# Altium project HDsEMG V1.0.PrjPcb
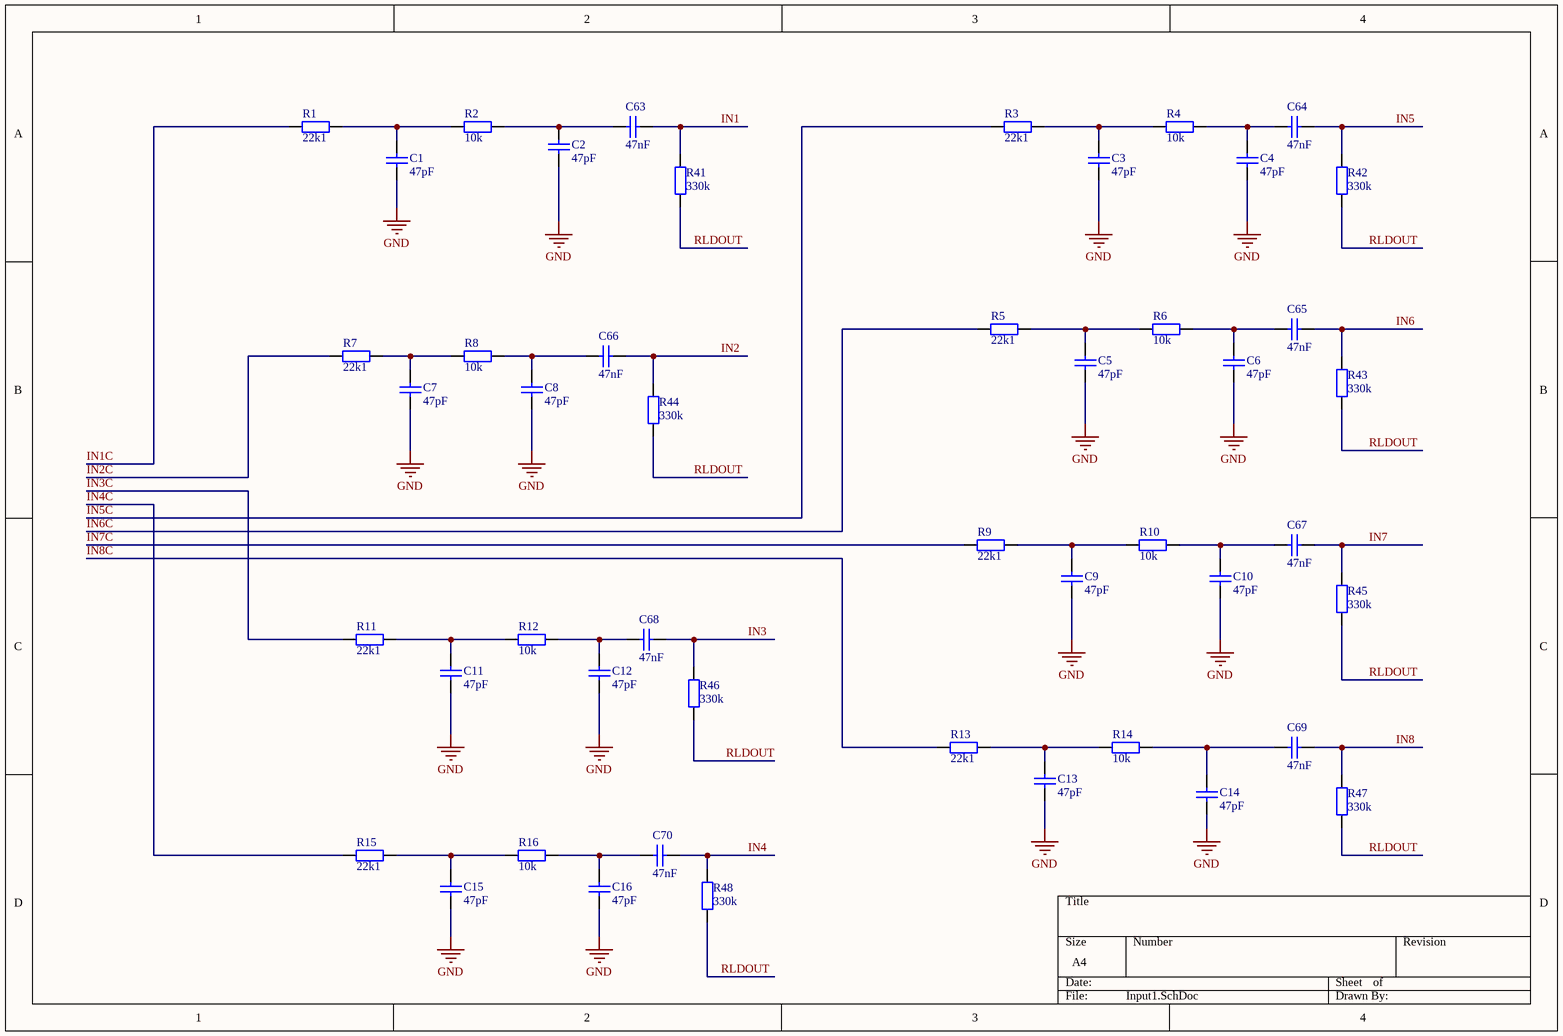
[diagram p0: Input1.SchDoc]
5 sheets, 160 parts. Net scope: global (net labels, ports and power ports of the same name join across sheets).
Board file: HDsEMG.PcbDoc
Sheets:
  Input1.SchDoc
  Input2.SchDoc
  ADS1298.SchDoc
  Power supply.SchDoc
  ESP32.SchDoc

## Sheet Input1.SchDoc
size A4

### Parts
C1  47pF  [C0603]
C2  47pF  [C0603]
C3  47pF  [C0603]
C4  47pF  [C0603]
C5  47pF  [C0603]
C6  47pF  [C0603]
C7  47pF  [C0603]
C8  47pF  [C0603]
C9  47pF  [C0603]
C10  47pF  [C0603]
C11  47pF  [C0603]
C12  47pF  [C0603]
C13  47pF  [C0603]
C14  47pF  [C0603]
C15  47pF  [C0603]
C16  47pF  [C0603]
C63  47nF  [C0603]
C64  47nF  [C0603]
C65  47nF  [C0603]
C66  47nF  [C0603]
C67  47nF  [C0603]
C68  47nF  [C0603]
C69  47nF  [C0603]
C70  47nF  [C0603]
R1  22k1  [RES0603]
R2  10k  [RES0603]
R3  22k1  [RES0603]
R4  10k  [RES0603]
R5  22k1  [RES0603]
R6  10k  [RES0603]
R7  22k1  [RES0603]
R8  10k  [RES0603]
R9  22k1  [RES0603]
R10  10k  [RES0603]
R11  22k1  [RES0603]
R12  10k  [RES0603]
R13  22k1  [RES0603]
R14  10k  [RES0603]
R15  22k1  [RES0603]
R16  10k  [RES0603]
R41  330k  [RES0603]
R42  330k  [RES0603]
R43  330k  [RES0603]
R44  330k  [RES0603]
R45  330k  [RES0603]
R46  330k  [RES0603]
R47  330k  [RES0603]
R48  330k  [RES0603]

### Nets
GND: C1.1 C2.1 C3.1 C4.1 C5.1 C6.1 C7.1 C8.1 C9.1 C10.1 C11.1 C12.1 C13.1 C14.1 C15.1 C16.1  [project net BAT_GND]
IN1: C63.1 R41.2
IN1C: R1.1
IN2: C66.1 R44.2
IN2C: R7.1
IN3: C68.1 R46.2
IN3C: R11.1
IN4: C70.1 R48.2
IN4C: R15.1
IN5: C64.1 R42.2
IN5C: R3.1
IN6: C65.1 R43.2
IN6C: R5.1
IN7: C67.1 R45.2
IN7C: R9.1
IN8: C69.1 R47.2
IN8C: R13.1
RLDOUT: R41.1 R42.1 R43.1 R44.1 R45.1 R46.1 R47.1 R48.1
NetC1_2: C1.2 R1.2 R2.1
NetC2_2: C2.2 C63.2 R2.2
NetC3_2: C3.2 R3.2 R4.1
NetC4_2: C4.2 C64.2 R4.2
NetC5_2: C5.2 R5.2 R6.1
NetC6_2: C6.2 C65.2 R6.2
NetC7_2: C7.2 R7.2 R8.1
NetC8_2: C8.2 C66.2 R8.2
NetC9_2: C9.2 R9.2 R10.1
NetC10_2: C10.2 C67.2 R10.2
NetC11_2: C11.2 R11.2 R12.1
NetC12_2: C12.2 C68.2 R12.2
NetC13_2: C13.2 R13.2 R14.1
NetC14_2: C14.2 C69.2 R14.2
NetC15_2: C15.2 R15.2 R16.1
NetC16_2: C16.2 C70.2 R16.2

### Library data of the parts
C1-C16 C63-C70 = Cap: Capacitor; Value: 100pF; Published: 8-Jun-2000; LatestRevisionDate: 17-Jul-2002; LatestRevisionNote: Re-released for DXP Platform.; PackageReference: RAD-0.3; Publisher: Altium Limited; PackageDescription: Radial Cap, Thru-Hole; 2 Leads; 0.3 in Pin Spacing
R1-R16 R41-R48 = Res2: Resistor; Value: 1K; Published: 8-Jun-2000; LatestRevisionDate: 17-Jul-2002; LatestRevisionNote: Re-released for DXP Platform.; PackageReference: AXIAL-0.4; Publisher: Altium Limited; PackageDescription: Axial Device, Thru-Hole; 2 Leads; 0.4 in Pin Spacing

## Sheet Input2.SchDoc
size A4
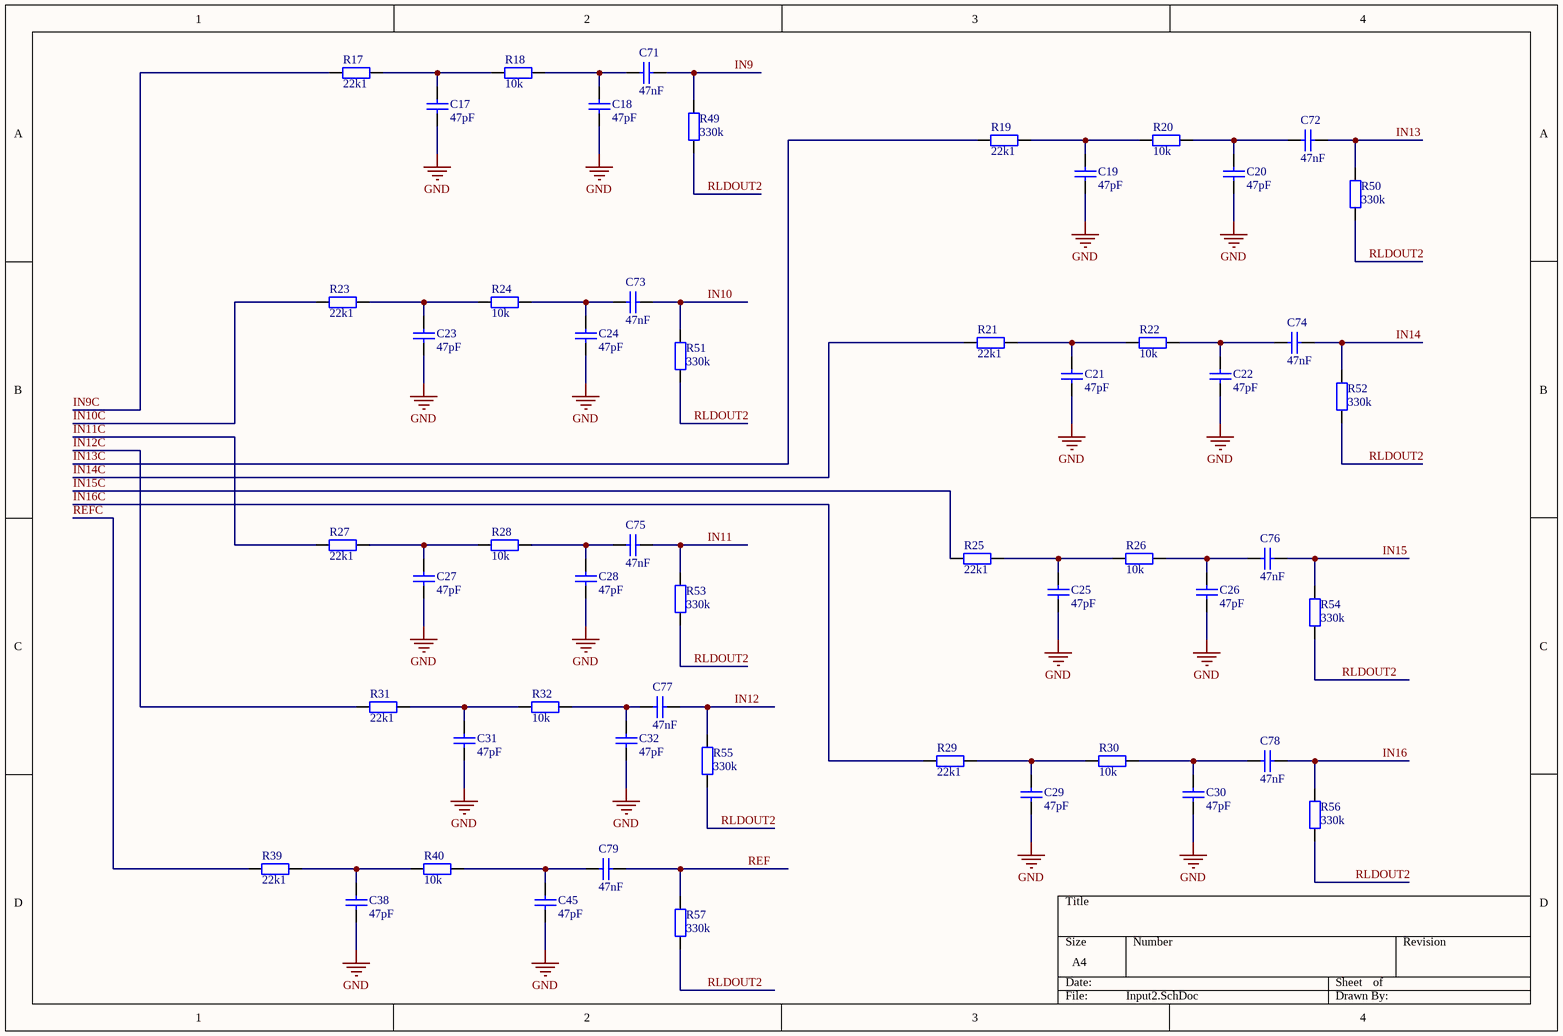
[diagram p1: Input2.SchDoc]

### Parts
C17  47pF  [C0603]
C18  47pF  [C0603]
C19  47pF  [C0603]
C20  47pF  [C0603]
C21  47pF  [C0603]
C22  47pF  [C0603]
C23  47pF  [C0603]
C24  47pF  [C0603]
C25  47pF  [C0603]
C26  47pF  [C0603]
C27  47pF  [C0603]
C28  47pF  [C0603]
C29  47pF  [C0603]
C30  47pF  [C0603]
C31  47pF  [C0603]
C32  47pF  [C0603]
C38  47pF  [C0603]
C45  47pF  [C0603]
C71  47nF  [C0603]
C72  47nF  [C0603]
C73  47nF  [C0603]
C74  47nF  [C0603]
C75  47nF  [C0603]
C76  47nF  [C0603]
C77  47nF  [C0603]
C78  47nF  [C0603]
C79  47nF  [C0603]
R17  22k1  [RES0603]
R18  10k  [RES0603]
R19  22k1  [RES0603]
R20  10k  [RES0603]
R21  22k1  [RES0603]
R22  10k  [RES0603]
R23  22k1  [RES0603]
R24  10k  [RES0603]
R25  22k1  [RES0603]
R26  10k  [RES0603]
R27  22k1  [RES0603]
R28  10k  [RES0603]
R29  22k1  [RES0603]
R30  10k  [RES0603]
R31  22k1  [RES0603]
R32  10k  [RES0603]
R39  22k1  [RES0603]
R40  10k  [RES0603]
R49  330k  [RES0603]
R50  330k  [RES0603]
R51  330k  [RES0603]
R52  330k  [RES0603]
R53  330k  [RES0603]
R54  330k  [RES0603]
R55  330k  [RES0603]
R56  330k  [RES0603]
R57  330k  [RES0603]

### Nets
GND: C17.1 C18.1 C19.1 C20.1 C21.1 C22.1 C23.1 C24.1 C25.1 C26.1 C27.1 C28.1 C29.1 C30.1 C31.1 C32.1 C38.1 C45.1  [project net BAT_GND]
IN9: C71.1 R49.2
IN9C: R17.1
IN10: C73.1 R51.2
IN10C: R23.1
IN11: C75.1 R53.2
IN11C: R27.1
IN12: C77.1 R55.2
IN12C: R31.1
IN13: C72.1 R50.2
IN13C: R19.1
IN14: C74.1 R52.2
IN14C: R21.1
IN15: C76.1 R54.2
IN15C: R25.1
IN16: C78.1 R56.2
IN16C: R29.1
REF: C79.1 R57.2
REFC: R39.1
RLDOUT2: R49.1 R50.1 R51.1 R52.1 R53.1 R54.1 R55.1 R56.1 R57.1
NetC17_2: C17.2 R17.2 R18.1
NetC18_2: C18.2 C71.2 R18.2
NetC19_2: C19.2 R19.2 R20.1
NetC20_2: C20.2 C72.2 R20.2
NetC21_2: C21.2 R21.2 R22.1
NetC22_2: C22.2 C74.2 R22.2
NetC23_2: C23.2 R23.2 R24.1
NetC24_2: C24.2 C73.2 R24.2
NetC25_2: C25.2 R25.2 R26.1
NetC26_2: C26.2 C76.2 R26.2
NetC27_2: C27.2 R27.2 R28.1
NetC28_2: C28.2 C75.2 R28.2
NetC29_2: C29.2 R29.2 R30.1
NetC30_2: C30.2 C78.2 R30.2
NetC31_2: C31.2 R31.2 R32.1
NetC32_2: C32.2 C77.2 R32.2
NetC38_2: C38.2 R39.2 R40.1
NetC45_2: C45.2 C79.2 R40.2

### Library data of the parts
C17-C32 C38 C45 C71-C79 = Cap: Capacitor; Value: 100pF; Published: 8-Jun-2000; LatestRevisionDate: 17-Jul-2002; LatestRevisionNote: Re-released for DXP Platform.; PackageReference: RAD-0.3; Publisher: Altium Limited; PackageDescription: Radial Cap, Thru-Hole; 2 Leads; 0.3 in Pin Spacing
R17-R32 R39 R40 R49-R57 = Res2: Resistor; Value: 1K; Published: 8-Jun-2000; LatestRevisionDate: 17-Jul-2002; LatestRevisionNote: Re-released for DXP Platform.; PackageReference: AXIAL-0.4; Publisher: Altium Limited; PackageDescription: Axial Device, Thru-Hole; 2 Leads; 0.4 in Pin Spacing

## Sheet ADS1298.SchDoc
size A4
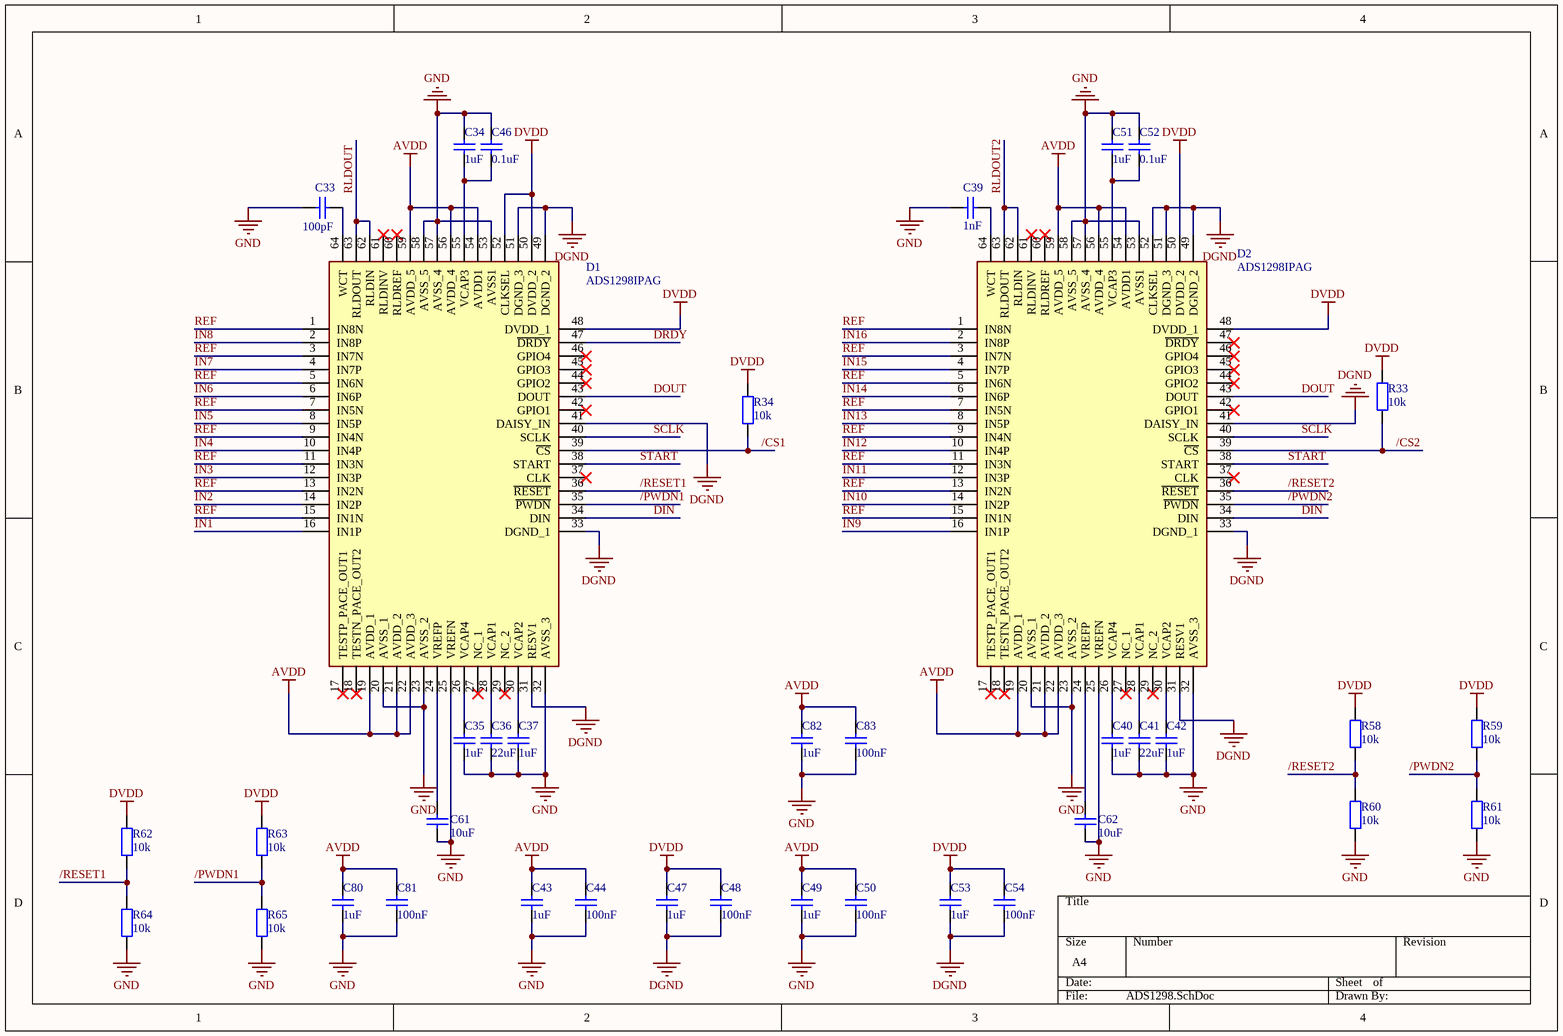
[diagram p2: ADS1298.SchDoc]

### Parts
C33  100pF  [C0603]
C34  1uF  [C0603]
C35  1uF  [C0603]
C36  22uF  [C0603]
C37  1uF  [C0603]
C39  1nF  [C0603]
C40  1uF  [C0603]
C41  22uF  [C0603]
C42  1uF  [C0603]
C43  1uF  [C0603]
C44  100nF  [C0603]
C46  0.1uF  [C0603]
C47  1uF  [C0603]
C48  100nF  [C0603]
C49  1uF  [C0603]
C50  100nF  [C0603]
C51  1uF  [C0603]
C52  0.1uF  [C0603]
C53  1uF  [C0603]
C54  100nF  [C0603]
C61  10uF  [C0603]
C62  10uF  [C0603]
C80  1uF  [C0603]
C81  100nF  [C0603]
C82  1uF  [C0603]
C83  100nF  [C0603]
D1  ADS1298IPAG  [ADS1298]
D2  ADS1298IPAG  [ADS1298]
R33  10k  [RES0603]
R34  10k  [RES0603]
R58  10k  [RES0603]
R59  10k  [RES0603]
R60  10k  [RES0603]
R61  10k  [RES0603]
R62  10k  [RES0603]
R63  10k  [RES0603]
R64  10k  [RES0603]
R65  10k  [RES0603]

### Nets
AVDD: C43.1 C44.1 C49.1 C50.1 C80.1 C81.1 C82.1 C83.1 D1.19(AVDD_1) D1.21(AVDD_2) D1.22(AVDD_3) D1.54(AVDD1) D1.56(AVDD_4) D1.59(AVDD_5) D2.19(AVDD_1) D2.21(AVDD_2) D2.22(AVDD_3) D2.54(AVDD1) D2.56(AVDD_4) D2.59(AVDD_5)
DGND: C47.2 C48.2 C53.2 C54.2 D1.31(RESV1) D1.33(DGND_1) D1.41(DAISY_IN) D1.49(DGND_2) D1.51(DGND_3) D2.31(RESV1) D2.33(DGND_1) D2.41(DAISY_IN) D2.49(DGND_2) D2.51(DGND_3) D2.52(CLKSEL)
DVDD: C47.1 C48.1 C53.1 C54.1 D1.48(DVDD_1) D1.50(DVDD_2) D1.52(CLKSEL) D2.48(DVDD_1) D2.50(DVDD_2) R33.2 R34.2 R58.2 R59.2 R62.2 R63.2
GND: C33.2 C34.2 C35.2 C36.2 C37.2 C39.2 C40.2 C41.2 C42.2 C43.2 C44.2 C46.2 C49.2 C50.2 C51.2 C52.2 C61.1 C62.1 C80.2 C81.2 C82.2 C83.2 D1.20(AVSS_1) D1.23(AVSS_2) D1.25(VREFN) D1.32(AVSS_3) D1.53(AVSS1) D1.57(AVSS_4) D1.58(AVSS_5) D2.20(AVSS_1) D2.23(AVSS_2) D2.25(VREFN) D2.32(AVSS_3) D2.53(AVSS1) D2.57(AVSS_4) D2.58(AVSS_5) R60.1 R61.1 R64.1 R65.1  [project net BAT_GND]
/CS1: D1.39(~{CS}) R34.1
/CS2: D2.39(~{CS}) R33.1
/PWDN1: D1.35(~{PWDN}) R63.1 R65.2
/PWDN2: D2.35(~{PWDN}) R59.1 R61.2
/RESET1: D1.36(~{RESET}) R62.1 R64.2
/RESET2: D2.36(~{RESET}) R58.1 R60.2
DIN: D1.34(DIN) D2.34(DIN)
DOUT: D1.43(DOUT) D2.43(DOUT)
DRDY: D1.47(~{DRDY})
IN1: D1.16(IN1P)
IN2: D1.14(IN2P)
IN3: D1.12(IN3P)
IN4: D1.10(IN4P)
IN5: D1.8(IN5P)
IN6: D1.6(IN6P)
IN7: D1.4(IN7P)
IN8: D1.2(IN8P)
IN9: D2.16(IN1P)
IN10: D2.14(IN2P)
IN11: D2.12(IN3P)
IN12: D2.10(IN4P)
IN13: D2.8(IN5P)
IN14: D2.6(IN6P)
IN15: D2.4(IN7P)
IN16: D2.2(IN8P)
REF: D1.1(IN8N) D1.3(IN7N) D1.5(IN6N) D1.7(IN5N) D1.9(IN4N) D1.11(IN3N) D1.13(IN2N) D1.15(IN1N) D2.1(IN8N) D2.3(IN7N) D2.5(IN6N) D2.7(IN5N) D2.9(IN4N) D2.11(IN3N) D2.13(IN2N) D2.15(IN1N)
RLDOUT: D1.62(RLDIN) D1.63(RLDOUT)
RLDOUT2: D2.62(RLDIN) D2.63(RLDOUT)
SCLK: D1.40(SCLK) D2.40(SCLK)
START: D1.38(START) D2.38(START)
NetC33_1: C33.1 D1.64(WCT)
NetC34_1: C34.1 C46.1 D1.55(VCAP3)
NetC35_1: C35.1 D1.26(VCAP4)
NetC36_1: C36.1 D1.28(VCAP1)
NetC37_1: C37.1 D1.30(VCAP2)
NetC39_1: C39.1 D2.64(WCT)
NetC40_1: C40.1 D2.26(VCAP4)
NetC41_1: C41.1 D2.28(VCAP1)
NetC42_1: C42.1 D2.30(VCAP2)
NetC51_1: C51.1 C52.1 D2.55(VCAP3)
NetC61_2: C61.2 D1.24(VREFP)
NetC62_2: C62.2 D2.24(VREFP)

Not connected (* = marked no-connect by the designer): D1 17(TESTP_PACE_OUT1)* 18(TESTN_PACE_OUT2)* 27(NC_1)* 29(NC_2)* 37(CLK)* 42(GPIO1)* 44(GPIO2)* 45(GPIO3)* 46(GPIO4)* 60(RLDREF)* 61(RLDINV)*; D2 17(TESTP_PACE_OUT1)* 18(TESTN_PACE_OUT2)* 27(NC_1)* 29(NC_2)* 37(CLK)* 42(GPIO1)* 44(GPIO2)* 45(GPIO3)* 46(GPIO4)* 47(~{DRDY})* 60(RLDREF)* 61(RLDINV)*

### Library data of the parts
C33 = Cap: Capacitor; Published: 8-Jun-2000; LatestRevisionDate: 17-Jul-2002; LatestRevisionNote: Re-released for DXP Platform.; PackageReference: RAD-0.3; Publisher: Altium Limited; PackageDescription: Radial Cap, Thru-Hole; 2 Leads; 0.3 in Pin Spacing; Value: 100pF
C34-C37 C39-C44 C46-C54 C61 C62 C80-C83 = Cap: Capacitor; Value: 100pF; Published: 8-Jun-2000; LatestRevisionDate: 17-Jul-2002; LatestRevisionNote: Re-released for DXP Platform.; PackageReference: RAD-0.3; Publisher: Altium Limited; PackageDescription: Radial Cap, Thru-Hole; 2 Leads; 0.3 in Pin Spacing
D1 D2 = ADS1298IPAG: Integrated Circuit; Manufacturer_Name: Texas Instruments; Datasheet Link: http://www.ti.com/lit/ds/symlink/ads1298.pdf; Height: 1.2mm; Manufacturer_Part_Number: ADS1298IPAG; Mouser Part Number: 595-ADS1298IPAG; Mouser Price/Stock: https://www.mouser.co.uk/ProductDetail/Texas-Instruments/ADS1298IPAG?qs=Z6FgPJT5dDR3VNlC6H4EKg%3D%3D; Arrow Part Number: ADS1298IPAG; Arrow Price/Stock: https://www.arrow.com/en/products/ads1298ipag/texas-instruments
R33 R34 R58-R65 = Res2: Resistor; Value: 1K; Published: 8-Jun-2000; LatestRevisionDate: 17-Jul-2002; LatestRevisionNote: Re-released for DXP Platform.; PackageReference: AXIAL-0.4; Publisher: Altium Limited; PackageDescription: Axial Device, Thru-Hole; 2 Leads; 0.4 in Pin Spacing

## Sheet Power supply.SchDoc
size A4
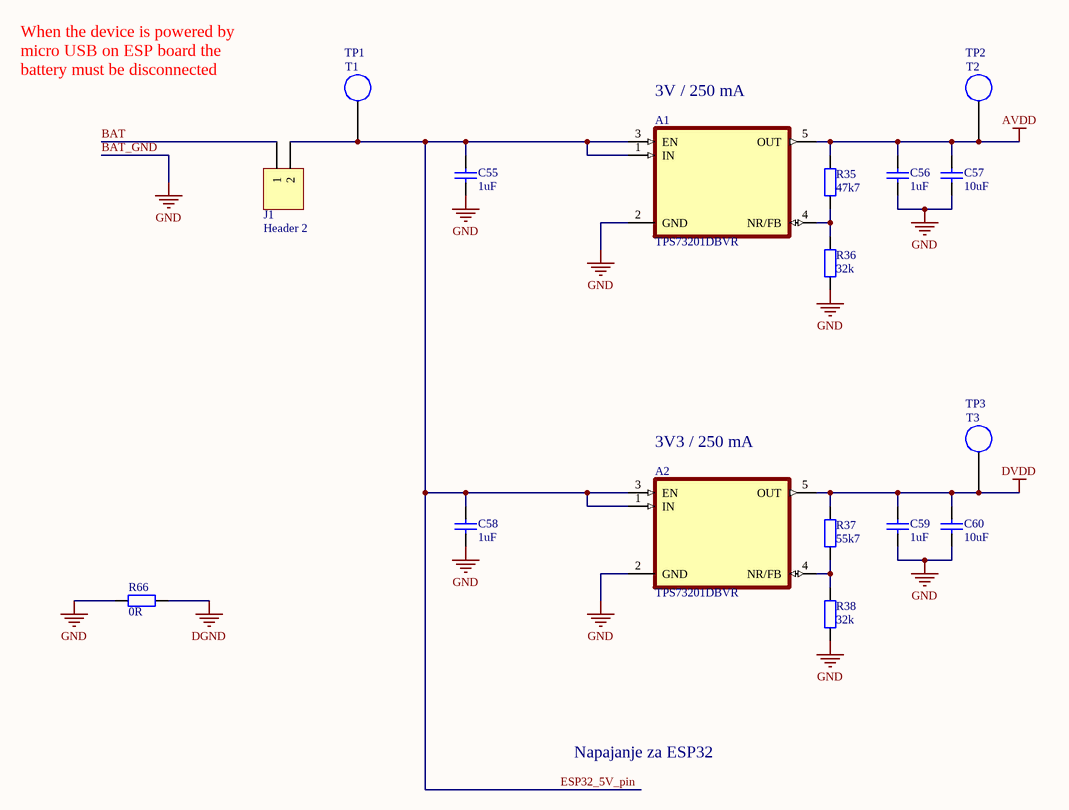
[diagram p3: Power supply.SchDoc]

### Parts
A1  TPS73201DBVR  [SOT95P280X145-5N]
A2  TPS73201DBVR  [SOT95P280X145-5N]
C55  1uF  [C0603]
C56  1uF  [C0603]
C57  10uF  [C0603]
C58  1uF  [C0603]
C59  1uF  [C0603]
C60  10uF  [C0603]
J1  Header 2  [HDR1X2]
R35  47k7  [RES0603]
R36  32k  [RES0603]
R37  55k7  [RES0603]
R38  32k  [RES0603]
R66  0R  [RES0603]
T1  TP1  [PCBComponent_1]
T2  TP2  [PCBComponent_1]
T3  TP3  [PCBComponent_1]

### Nets
AVDD: A1.5(OUT) C56.2 C57.2 R35.2 T2.1
BAT_GND: A1.2(GND) A2.2(GND) C55.1 C56.1 C57.1 C58.1 C59.1 C60.1 R36.1 R38.1 R66.2  [also labelled GND]
DGND: R66.1
DVDD: A2.5(OUT) C59.2 C60.2 R37.2 T3.1
BAT: J1.1
ESP32_5V_pin: A1.1(IN) A1.3(EN) A2.1(IN) A2.3(EN) C55.2 C58.2 J1.2 T1.1
NetA1_4: A1.4(NR/FB) R35.1 R36.2
NetA2_4: A2.4(NR/FB) R37.1 R38.2

### Notes on the sheet
- When the device is powered by micro USB on ESP board the battery must be disconnected
- (near A1) 3V / 250 mA
- (near A2) 3V3 / 250 mA
- Napajanje za ESP32

### Library data of the parts
A1 A2 = TPS73201DBVR: 250-mA, high-accuracy, ultra-low-dropout voltage regulator with reverse current protection & enable 5-SOT-23 -40 to 125; MF: Texas Instruments; DigiKey-Purchase-URL: https://snapeda.com/shop?store=DigiKey&id=76590; Package: SOT-23-5 Texas Instruments; Mouser-Purchase-URL: https://snapeda.com/shop?store=Mouser&id=76590; Texas_Instruments-Purchase-URL: https://snapeda.com/shop?store=Texas+Instruments&id=76590; MP: TPS73201DBVR; SnapEDA_Link: https://www.snapeda.com/parts/TPS73201DBVR/Texas%20Instruments/view-part/76590/?ref=snap; Arrow_Electronics-Purchase-URL: https://snapeda.com/shop?store=Arrow+Electronics&id=76590; Value: *
C55-C60 = Cap: Capacitor; Value: 100pF; Published: 8-Jun-2000; LatestRevisionDate: 17-Jul-2002; LatestRevisionNote: Re-released for DXP Platform.; PackageReference: RAD-0.3; Publisher: Altium Limited; PackageDescription: Radial Cap, Thru-Hole; 2 Leads; 0.3 in Pin Spacing
J1 = Header 2: Header, 2-Pin; LatestRevisionDate: 17-Jul-2002; LatestRevisionNote: Re-released for DXP Platform.; Publisher: Altium Limited
R35-R38 R66 = Res2: Resistor; Value: 1K; Published: 8-Jun-2000; LatestRevisionDate: 17-Jul-2002; LatestRevisionNote: Re-released for DXP Platform.; PackageReference: AXIAL-0.4; Publisher: Altium Limited; PackageDescription: Axial Device, Thru-Hole; 2 Leads; 0.4 in Pin Spacing
T1-T3 = Component_1

## Sheet ESP32.SchDoc
size A4
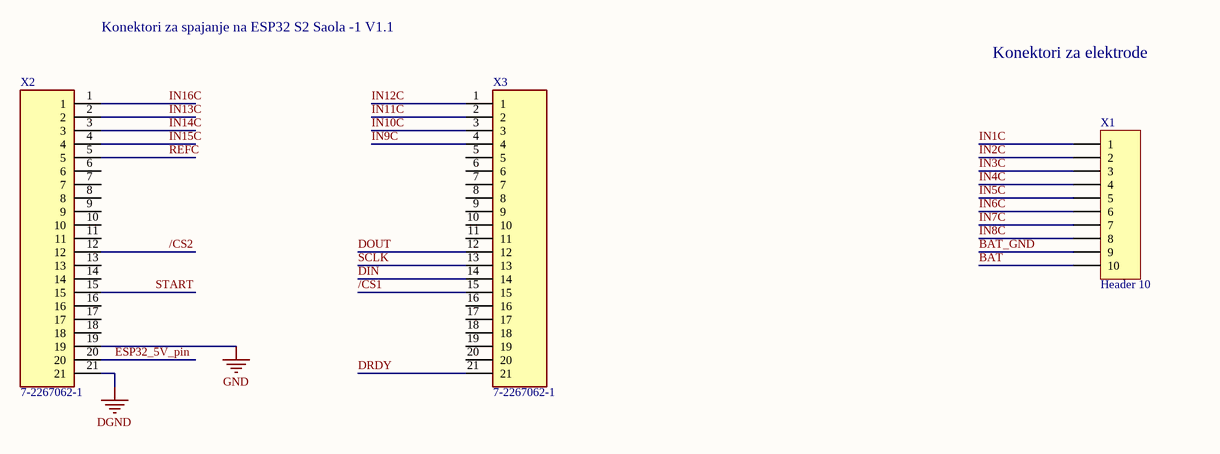
[diagram p4: ESP32.SchDoc]

### Parts
X1  Header 10  [HDR1X10]
X2  7-2267062-1  [TE_7-2267062-1]
X3  7-2267062-1  [TE_7-2267062-1]

### Nets
BAT_GND: X1.9 X2.19  [also labelled GND]
DGND: X2.21
/CS1: X3.15
/CS2: X2.12
BAT: X1.10
DIN: X3.14
DOUT: X3.12
DRDY: X3.21
ESP32_5V_pin: X2.20
IN1C: X1.1
IN2C: X1.2
IN3C: X1.3
IN4C: X1.4
IN5C: X1.5
IN6C: X1.6
IN7C: X1.7
IN8C: X1.8
IN9C: X3.4
IN10C: X3.3
IN11C: X3.2
IN12C: X3.1
IN13C: X2.2
IN14C: X2.3
IN15C: X2.4
IN16C: X2.1
REFC: X2.5
SCLK: X3.13
START: X2.15

Not connected (* = marked no-connect by the designer): X2 6 7 8 9 10 11 13 14 16 17 18; X3 5 6 7 8 9 10 11 16 17 18 19 20

### Notes on the sheet
- Konektori za spajanje na ESP32 S2 Saola -1 V1.1
- Konektori za elektrode

### Library data of the parts
X1 = Header 10: Header, 10-Pin; LatestRevisionDate: 17-Jul-2002; LatestRevisionNote: Re-released for DXP Platform.; Publisher: Altium Limited
X2 X3 = 7-2267062-1: Package: None; Price: None; Value: *; MP: 7-2267062-1; Availability: Unavailable

## Nets that join several sheets
AVDD: ADS1298 (20 pins), Power supply (5 pins)
BAT_GND: Input1 (16 pins), Input2 (18 pins), ADS1298 (40 pins), Power supply (11 pins), ESP32 (X1.9 X2.19)
DGND: ADS1298 (15 pins), Power supply (R66.1), ESP32 (X2.21)
DVDD: ADS1298 (15 pins), Power supply (5 pins)
/CS1: ADS1298 (D1.39 R34.1), ESP32 (X3.15)
/CS2: ADS1298 (D2.39 R33.1), ESP32 (X2.12)
BAT: Power supply (J1.1), ESP32 (X1.10)
DIN: ADS1298 (D1.34 D2.34), ESP32 (X3.14)
DOUT: ADS1298 (D1.43 D2.43), ESP32 (X3.12)
DRDY: ADS1298 (D1.47), ESP32 (X3.21)
ESP32_5V_pin: Power supply (8 pins), ESP32 (X2.20)
IN1: Input1 (C63.1 R41.2), ADS1298 (D1.16)
IN1C: Input1 (R1.1), ESP32 (X1.1)
IN2: Input1 (C66.1 R44.2), ADS1298 (D1.14)
IN2C: Input1 (R7.1), ESP32 (X1.2)
IN3: Input1 (C68.1 R46.2), ADS1298 (D1.12)
IN3C: Input1 (R11.1), ESP32 (X1.3)
IN4: Input1 (C70.1 R48.2), ADS1298 (D1.10)
IN4C: Input1 (R15.1), ESP32 (X1.4)
IN5: Input1 (C64.1 R42.2), ADS1298 (D1.8)
IN5C: Input1 (R3.1), ESP32 (X1.5)
IN6: Input1 (C65.1 R43.2), ADS1298 (D1.6)
IN6C: Input1 (R5.1), ESP32 (X1.6)
IN7: Input1 (C67.1 R45.2), ADS1298 (D1.4)
IN7C: Input1 (R9.1), ESP32 (X1.7)
IN8: Input1 (C69.1 R47.2), ADS1298 (D1.2)
IN8C: Input1 (R13.1), ESP32 (X1.8)
IN9: Input2 (C71.1 R49.2), ADS1298 (D2.16)
IN9C: Input2 (R17.1), ESP32 (X3.4)
IN10: Input2 (C73.1 R51.2), ADS1298 (D2.14)
IN10C: Input2 (R23.1), ESP32 (X3.3)
IN11: Input2 (C75.1 R53.2), ADS1298 (D2.12)
IN11C: Input2 (R27.1), ESP32 (X3.2)
IN12: Input2 (C77.1 R55.2), ADS1298 (D2.10)
IN12C: Input2 (R31.1), ESP32 (X3.1)
IN13: Input2 (C72.1 R50.2), ADS1298 (D2.8)
IN13C: Input2 (R19.1), ESP32 (X2.2)
IN14: Input2 (C74.1 R52.2), ADS1298 (D2.6)
IN14C: Input2 (R21.1), ESP32 (X2.3)
IN15: Input2 (C76.1 R54.2), ADS1298 (D2.4)
IN15C: Input2 (R25.1), ESP32 (X2.4)
IN16: Input2 (C78.1 R56.2), ADS1298 (D2.2)
IN16C: Input2 (R29.1), ESP32 (X2.1)
REF: Input2 (C79.1 R57.2), ADS1298 (16 pins)
REFC: Input2 (R39.1), ESP32 (X2.5)
RLDOUT: Input1 (8 pins), ADS1298 (D1.62 D1.63)
RLDOUT2: Input2 (9 pins), ADS1298 (D2.62 D2.63)
SCLK: ADS1298 (D1.40 D2.40), ESP32 (X3.13)
START: ADS1298 (D1.38 D2.38), ESP32 (X2.15)

## Assembly variants
Variant of HDsEMG V1.0: not fitted R59 R60 R61 R63 R64 R65 X2 X3